# Altium schematic sheet Sensors.SchDoc
size A4; SheetNumber: 5; SheetTotal: 7
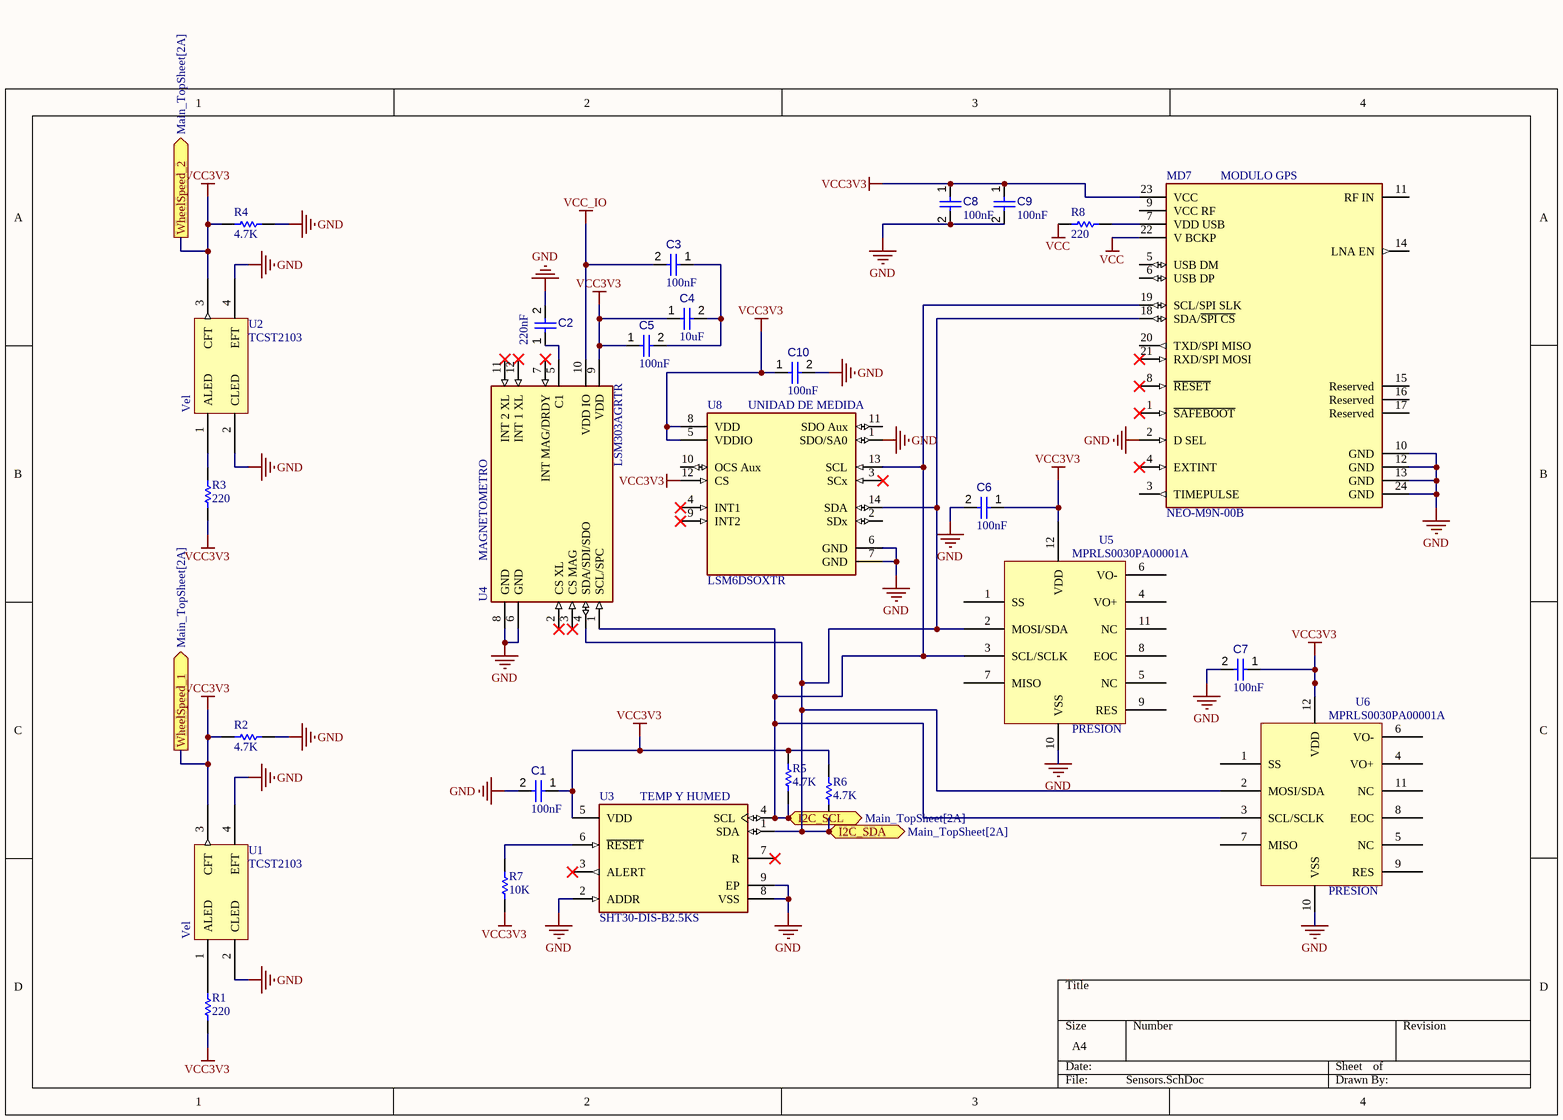
[diagram p0: Sensors.SchDoc]

## Parts
C1  value 100nF  [CAPC0402(1005)60_L]  (hidden comment: Capacitor 100nF +/-20% 10V 0402)
C2  value 220nF  [CAPC0402(1005)60_L]  (hidden comment: Capacitor 100nF +/-20% 10V 0402)
C3  value 100nF  [CAPC0402(1005)60_L]  (hidden comment: Capacitor 100nF +/-20% 10V 0402)
C4  value 10uF  [CAPC0402(1005)60_L]  (hidden comment: Capacitor 100nF +/-20% 10V 0402)
C5  value 100nF  [CAPC0402(1005)60_L]  (hidden comment: Capacitor 100nF +/-20% 10V 0402)
C6  value 100nF  [CAPC0402(1005)60_L]  (hidden comment: Capacitor 100nF +/-20% 10V 0402)
C7  value 100nF  [CAPC0402(1005)60_L]  (hidden comment: Capacitor 100nF +/-20% 10V 0402)
C8  value 100nF  [CAPC0402(1005)60_L]  (hidden comment: Capacitor 100nF +/-20% 10V 0402)
C9  value 100nF  [CAPC0402(1005)60_L]  (hidden comment: Capacitor 100nF +/-20% 10V 0402)
C10  value 100nF  [CAPC0402(1005)60_L]  (hidden comment: Capacitor 100nF +/-20% 10V 0402)
MD7  NEO-M9N-00B  [FP-NEO-M9N-00B-MFG]
R1  value 220  [RESC1005X40X25ML05T10]  (hidden comment: Resistor 51k +/-5% 0402 63 mW)
R2  value 4.7K  [RESC1005X40X25ML05T10]  (hidden comment: Resistor 51k +/-5% 0402 63 mW)
R3  value 220  [RESC1005X40X25ML05T10]  (hidden comment: Resistor 51k +/-5% 0402 63 mW)
R4  value 4.7K  [RESC1005X40X25ML05T10]  (hidden comment: Resistor 51k +/-5% 0402 63 mW)
R5  value 4.7K  [RESC1005X40X25ML05T10]  (hidden comment: Resistor 51k +/-5% 0402 63 mW)
R6  value 4.7K  [RESC1005X40X25ML05T10]  (hidden comment: Resistor 51k +/-5% 0402 63 mW)
R7  value 10K  [RESC1005X40X25ML05T10]  (hidden comment: Resistor 51k +/-5% 0402 63 mW)
R8  value 220  [RESC1005X40X25ML05T10]  (hidden comment: Resistor 51k +/-5% 0402 63 mW)
U1  TCST2103  [TCST2103-Footprint-1]
U2  TCST2103  [TCST2103-Footprint-1]
U3  SHT30-DIS-B2.5KS  [FP-SHT30-DIS-B2_5KS-MFG]
U4  LSM303AGRTR  [FP-LGA-12-8487206-MFG]
U5  MPRLS0030PA00001A  [LGA12C85P2X6_500X500X150]
U6  MPRLS0030PA00001A  [LGA12C85P2X6_500X500X150]
U8  LSM6DSOXTR  [FP-LGA-14L-DM00249496-MFG]

## Ports
I2C_SCL (bidir, see Main_TopSheet[2A]), I2C_SDA (bidir, see Main_TopSheet[2A]), WheelSpeed_1 (out, see Main_TopSheet[2A]), WheelSpeed_2 (out, see Main_TopSheet[2A])

## Nets
GND: C1.2 C2.2 C6.2 C7.2 C8.2 C9.2 C10.2 MD7.2(D_SEL) MD7.10(GND) MD7.12(GND) MD7.13(GND) MD7.24(GND) R2.2 R4.2 U1.2(CLED) U1.4(EFT) U2.2(CLED) U2.4(EFT) U3.2(ADDR) U3.8(VSS) U3.9(EP) U4.6(GND) U4.8(GND) U5.10(VSS) U6.10(VSS) U8.1(SDO/SA0) U8.6(GND) U8.7(GND)
VCC: MD7.22(V_BCKP) R8.2
VCC3V3: C1.1 C4.1 C5.1 C6.1 C7.1 C8.1 C9.1 C10.1 MD7.23(VCC) R1.2 R2.1 R3.2 R4.1 R5.1 R6.1 R7.2 U1.3(CFT) U2.3(CFT) U3.5(VDD) U4.9(VDD) U5.12(VDD) U6.12(VDD) U8.5(VDDIO) U8.8(VDD) U8.12(CS) ; port WheelSpeed_1, port WheelSpeed_2
VCC_IO: C3.2 U4.10(VDD_IO)
I2C_SCL: MD7.19(SCL/SPI_SLK) R5.2 U3.4(SCL) U4.1(SCL/SPC) U5.3(SCL/SCLK) U6.3(SCL/SCLK) U8.13(SCL) ; port I2C_SCL
I2C_SDA: MD7.18(SDA/~{SPI_CS}) R6.2 U3.1(SDA) U4.4(SDA/SDI/SDO) U5.2(MOSI/SDA) U6.2(MOSI/SDA) U8.14(SDA) ; port I2C_SDA
NetC2_1: C2.1 U4.5(C1)
NetC3_1: C3.1 C4.2 C5.2
NetMD7_7: MD7.7(VDD_USB) R8.1
NetR1_1: R1.1 U1.1(ALED)
NetR3_1: R3.1 U2.1(ALED)
NetR7_1: R7.1 U3.6(~{RESET})

Not connected (* = marked no-connect by the designer): MD7 1(~{SAFEBOOT})* 3(TIMEPULSE) 4(EXTINT)* 5(USB_DM) 6(USB_DP) 8(~{RESET})* 9(VCC_RF) 11(RF_IN) 14(LNA_EN) 15(Reserved) 16(Reserved) 17(Reserved) 20(TXD/SPI_MISO) 21(RXD/SPI_MOSI)*; U3 3(ALERT)* 7(R)*; U4 2(CS_XL)* 3(CS_MAG)* 7(INT_MAG/DRDY)* 11(INT_2_XL)* 12(INT_1_XL)*; U5 1(SS) 4(VO+) 5(NC) 6(VO-) 7(MISO) 8(EOC) 9(RES) 11(NC); U6 1(SS) 4(VO+) 5(NC) 6(VO-) 7(MISO) 8(EOC) 9(RES) 11(NC); U8 2(SDx) 3(SCx)* 4(INT1)* 9(INT2)* 10(OCS_Aux) 11(SDO_Aux)

## Notes on the sheet
- (near MD7) MODULO GPS
- (near U8) UNIDAD DE MEDIDA
- (near U4) MAGNETOMETRO
- (near U5) PRESION
- (near U3) TEMP Y HUMED
- (near U6) PRESION
- (in symbol CMP-010-00024-2) Vel

## Library data of the parts
C1-C10 = CMP-001-00061-3: Chip Capacitor, 100nF +/-20%, 10V, 0402, Thickness 0.6 mm; Tolerance: 20%; Mounting Technology: SMT; Voltage Rating: 10V; Max Operating Temperature: 85°C; Pins: 2; Case/Package: 0402; Min Operating Temperature: -55°C
MD7 = CMP-207130-000006-2: M9 standard precision module; Manufacturer: u-blox; Min Supply Voltage: 1.65V; Sensitivity: -167dBm; Interface: I2C,SPI,UART,USB; Max Supply Voltage: 3.6V; Device Class L3: RF Receivers; Category: UNK; Temperature Range Low: -40°C; Temperature Range High: +85°C; ComponentLink2Description: Datasheet; Manufacturer Part Number: NEO-M9N-00B; ComponentLink2URL: https://www.u-blox.com/sites/default/files/NEO-M9N_DataSheet_%28UBX-19014285%29.pdf; Footprint Url: https://www.u-blox.com/sites/default/files/NEO-M9N_Integrationmanual_%28UBX-19014286%29.pdf; Height: 2.6mm; Automotive: No; RoHS: TRUE; Lead Free: Yes; Octopart: https://octopart.com/neo-m9n-00b-u-blox-107315722; Package: 0; Temperature: -40°C to +85°C; Device Class L1: Integrated Circuits (ICs); Device Class L2: RF Semiconductors and Devices
R1-R8 = CMP-009-00000-5: Chip Resistor, 51 KOhm, +/- 5%, 0.063 W, -55 to 155 degC, 0402 (1005 Metric); Power: 63mW; Case/Package: 0402; Min Operating Temperature: -55°C; Mounting Technology: SM; RoHS Compliant: True; Max Operating Temperature: 155°C; Tolerance: 5%; Pins: 2
U1 U2 = CMP-010-00024-2: Vishay TCST2103 CNY37 Photoelectric Fork Sensor Optoelectronic Sensing; Output Current: 100mA; Max Operating Temperature: 85°C; Min Operating Temperature: -55°C; Mounting Technology: Through Hole; Pins: 4
U3 = CMP-144040-000006-1: SENSOR HUMID/TEMP 5V I2C 3% SMD
U4 = CMP-2000-07465-2: IMU ACCEL/MAG I2C/SPI 12LGA; Manufacturer: STMicroelectronics; Accel Range: 2/4/8/16g; Operating Supply Current: 3.7-200uA; Sensor Output: I2C,SPI; Accel Resolution: 16bits; Max Supply Voltage: 3.6V; Min Supply Voltage: 1.71V; Mag Sense Range: 49.152gauss (g); Sensor Type: Temperature,Accelerometer,Magnetometer; Mouser Description: IMUs - Inertial Measurement Units Ultra-compact high-performance e-compass 3D accelerometer and 3D magnetometer module; Temperature Range High: +85°C; Package: LGA-12-8487206; Manufacturer Part Number: LSM303AGRTR; Category: IC; Device Class L3: Inertial Measurement Units (IMUs); Temperature: -40°C to +85°C; Device Class L2: Motion Sensors; ComponentLink2Description: Datasheet; Octopart: https://octopart.com/lsm303agrtr-stmicroelectronics-59386630; Automotive: No; Device Class L1: Sensors; Resolution: 16bits; RoHS: TRUE; Height: 1mm; ComponentLink2URL: https://www.st.com/resource/en/datasheet/lsm303agr.pdf; Lead Free: Yes; Temperature Range Low: -40°C; Footprint Url: https://www.st.com/content/ccc/resource/technical/document/technical_note/73/17/9c/16/dd/96/4a/01/CD00134799.pdf/files/CD00134799.pdf/jcr:content/translations/en.CD00134799.pdf; Digikey Description: IMU ACCEL/MAG I2C/SPI 12LGA
U5 U6 = CMP-010-00026-1: Piezoresistive Sensor, Absolute, 0Psi Min, 30Psi Max, 0.25%, 0.20-0.80V, Square, Board Mount; Min Supply Voltage: 1.8V; Max Supply Voltage: 3.6V; Max Operating Temperature: 85°C; Min Operating Temperature: -40°C
U8 = CMP-12177-000010-1: INEMO INERTIAL MODULE: 3D ACCELE; Manufacturer: STMicroelectronics; Sensor Type: Temperature,Accelerometer,Gyroscope; Accel Range: 2/4/8/16g; Accel Sensitivity: 0.061/0.122/0.244/0.488mV/g; Operating Supply Current: 0.55mA; Gyro Range: 125/250/500/1000/2000°/s; Gyro Sensitivity: 4.375/8.75/17.5/35/70LSB/°/s; Sensor Output: I2C,SPI,Other; Min Supply Voltage: 1.62V; Max Supply Voltage: 3.6V; Octopart: https://octopart.com/lsm6dsoxtr-stmicroelectronics-98102600; Package: LGA-14L-DM00249496; Footprint Url: https://www.st.com/content/ccc/resource/technical/document/technical_note/73/17/9c/16/dd/96/4a/01/CD00134799.pdf/files/CD00134799.pdf/jcr:content/translations/en.CD00134799.pdf; ComponentLink2Description: Datasheet; Mouser Description: LSM6DSOX: 3.6 V 3 Axis Accelerometer Gyroscope iNEMO Inertial Module - LGA-14L; ComponentLink2URL: https://www.st.com/resource/en/datasheet/lsm6dsox.pdf; Temperature Range Low: -40°C; Digikey Description: INEMO INERTIAL MODULE: 3D ACCELE; Lead Free: Yes; Device Class L3: Inertial Measurement Units (IMUs); Category: IC; Device Class L2: Motion Sensors; RoHS: TRUE; Temperature: -40°C to +85°C; Height: 0.86mm; Device Class L1: Sensors; Temperature Range High: +85°C; Manufacturer Part Number: LSM6DSOXTR; Automotive: No